# EAGLE design eCog117_Motion_Sensor (EAGLE 6.6.0)
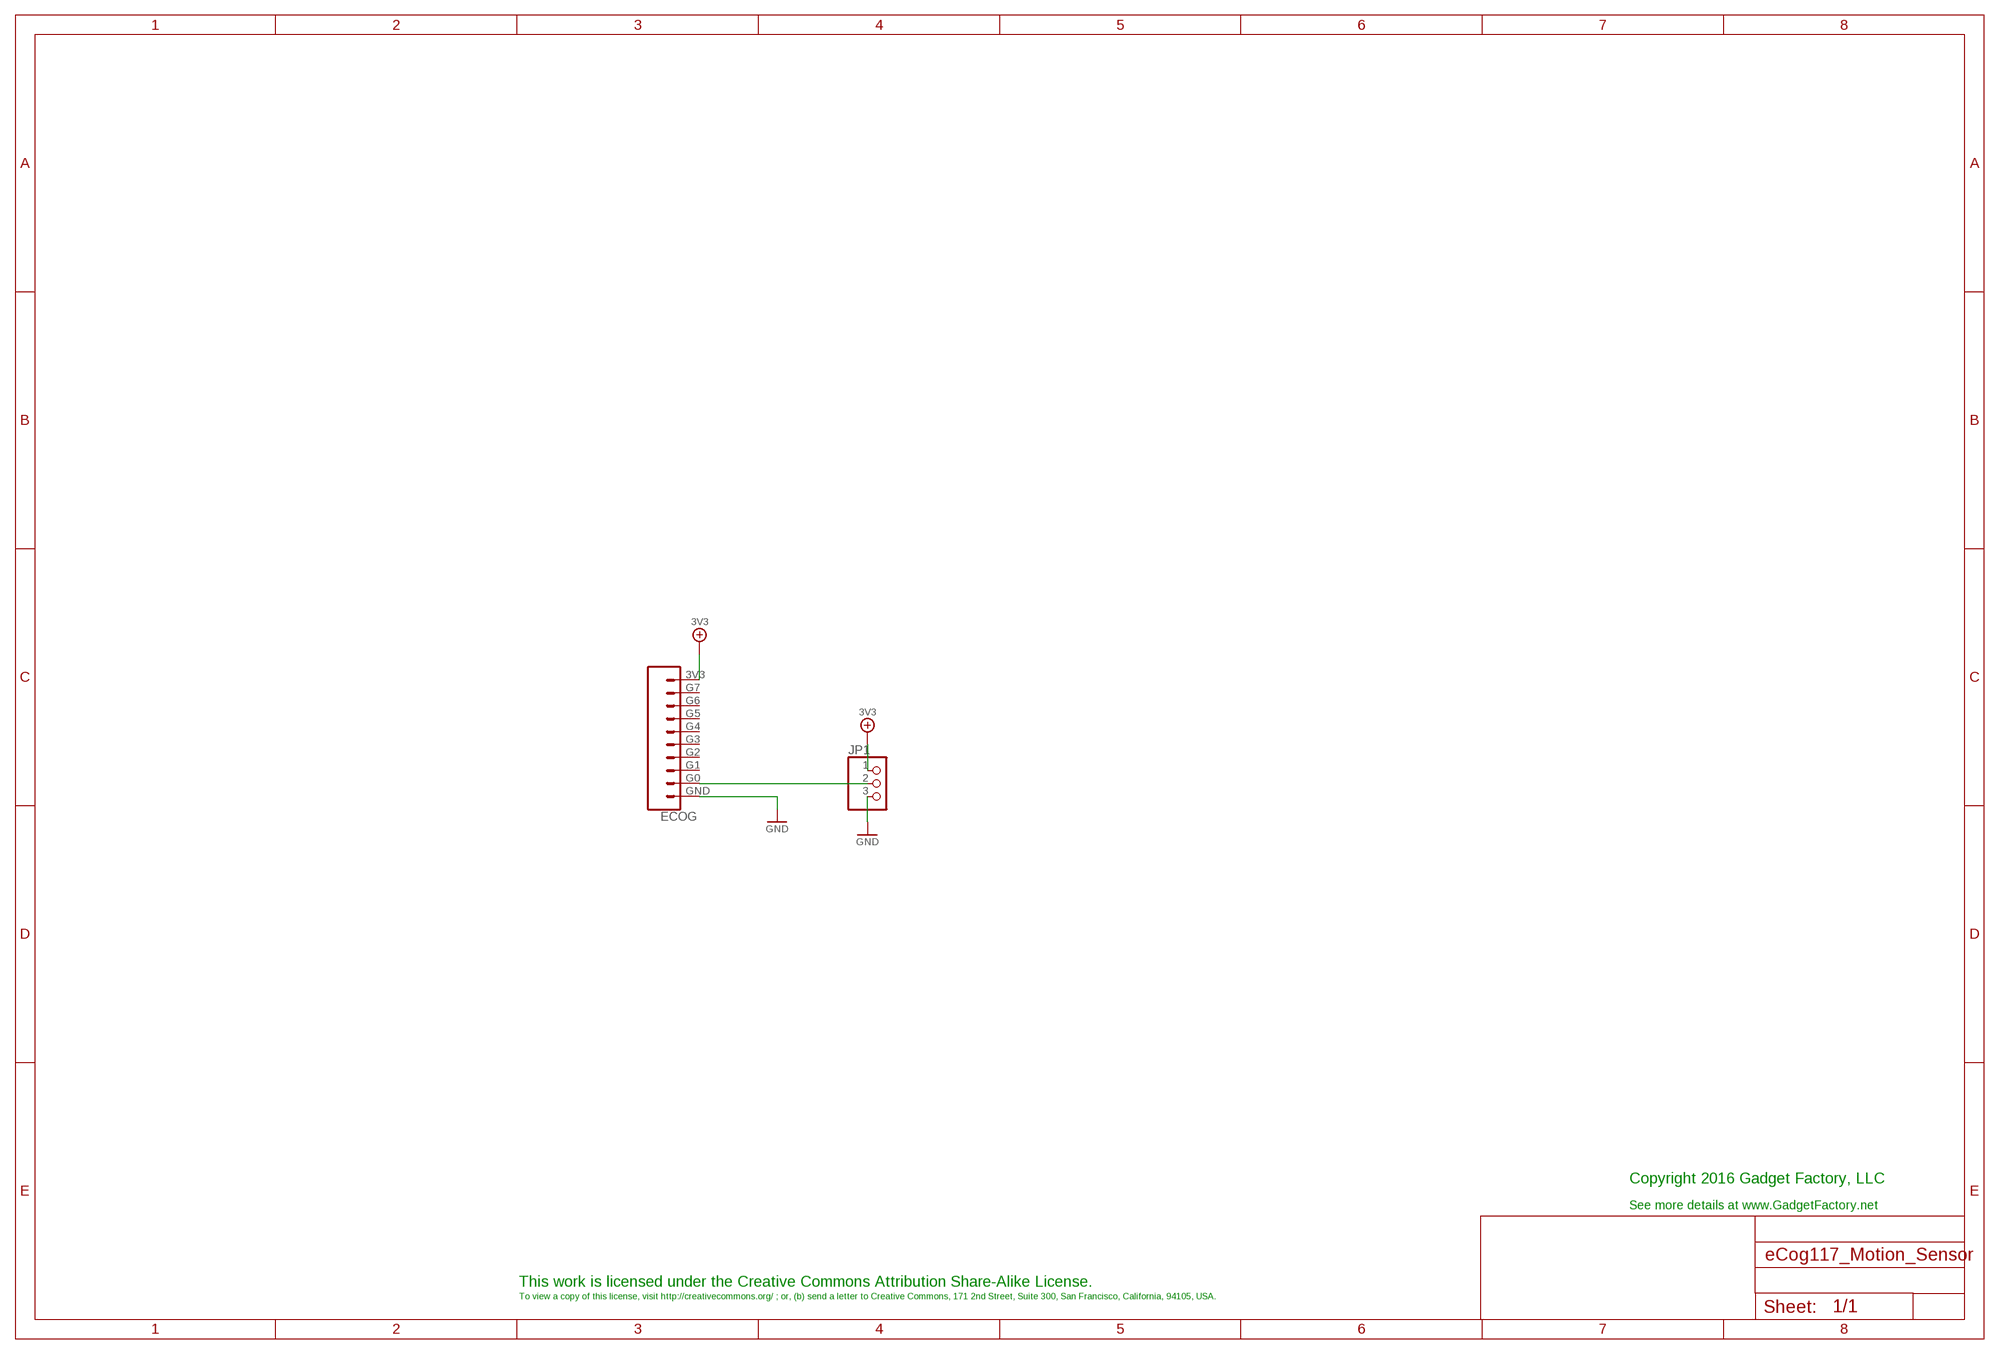
[diagram p0: schematic, sheet 1]

## Parts
ECOG  ECOG_GENERAL_ROWTHROUGHOLE  [ECOG_GENERAL_TH]
JP1  PINHD-1X3  [1X03]

## Nets
3V3: ECOG.3V3 JP1.1
GND: ECOG.GND JP1.3
N$1: ECOG.G0 JP1.2
Unconnected: ECOG.G1 ECOG.G2 ECOG.G3 ECOG.G4 ECOG.G5 ECOG.G6 ECOG.G7

## Notes on the sheet
- Copyright 2016 Gadget Factory, LLC
- See more details at www.GadgetFactory.net
- This work is licensed under the Creative Commons Attribution Share-Alike License.
- To view a copy of this license, visit http://creativecommons.org/ ; or, (b) send a letter to Creative Commons, 171 2nd Street, Suite 300, San Francisco, California, 94105, USA.

## Library data of the parts
ECOG = eCogs:ECOG_GENERAL_ROW
JP1 = pinhead:PINHD-1X3: PIN HEADER

## Board
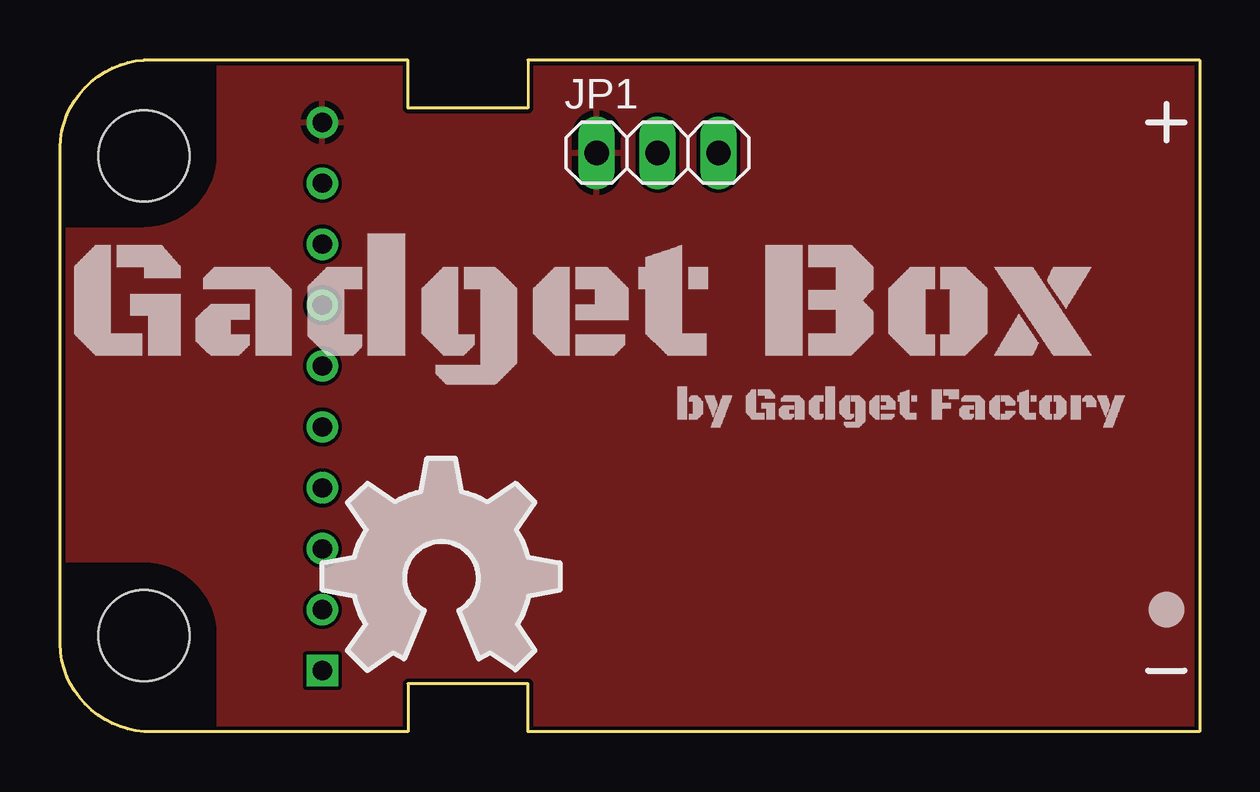
[diagram p1: board, top side]
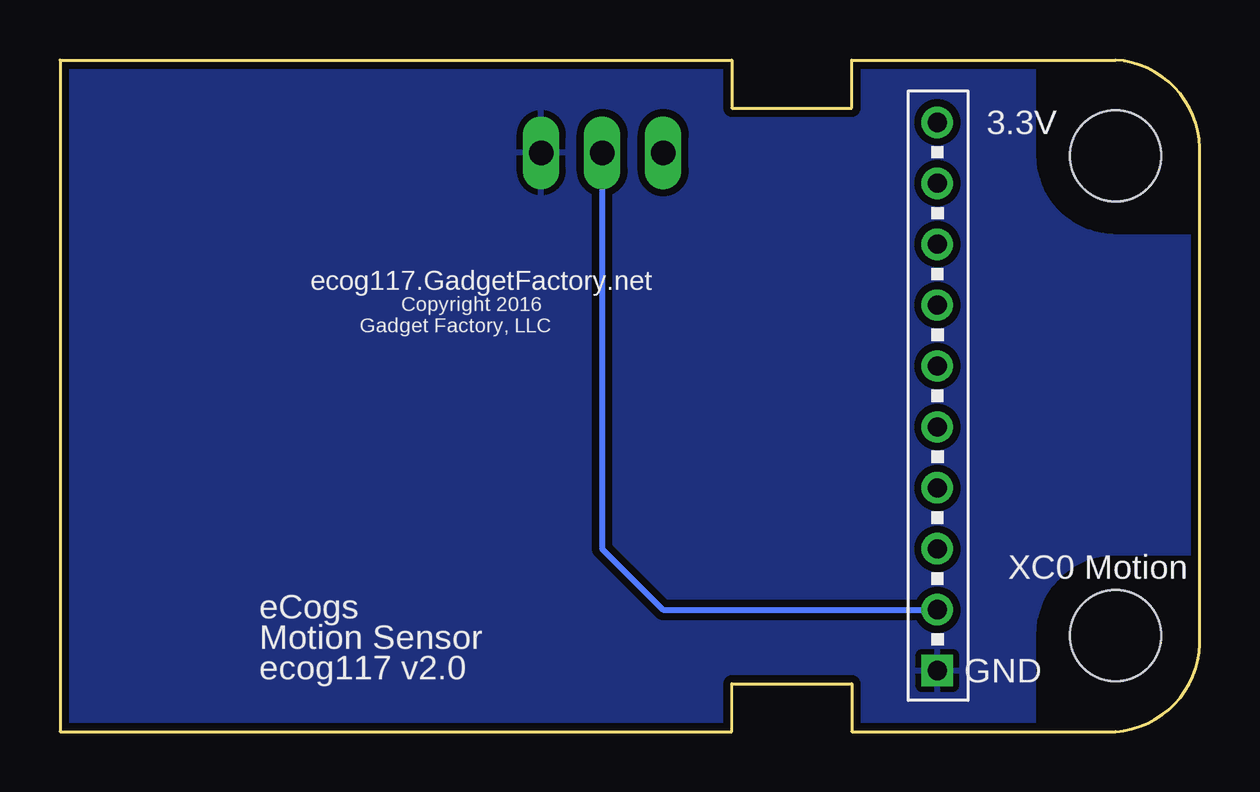
[diagram p2: board, bottom side, seen from below]

Size 47.51 x 28 mm. Coordinates in mm from the lower left corner, seen from the top.
Copper layers (1*16): Top 0.035mm / dielectric 1.5mm / Bottom 0.035mm
Design rules "hackvana *": minimum track width 6mil, minimum drill 0.3mm, track to track 6mil, track to pad 6mil, pad to pad 6mil, via to via 6mil, smd to smd 0mil, copper to edge 6mil, drill to drill 6mil, minimum pad ring 10mil, minimum via ring 6mil, stop-mask expansion 2mil, vias tented up to drill 100mil, thermal gap 10mil

### Footprints (pad centres in the part's own frame; a part is rotated, then mirrored left to right if it is on the bottom)
ECOG_GENERAL_TH = drill 0.8: 3V3 11.43,25.4; G0 11.43,5.08; G1 11.43,7.62; G2 11.43,10.16; G3 11.43,12.7; G4 11.43,15.24; G5 11.43,17.78; G6 11.43,20.32; G7 11.43,22.86 | drill 0.8 square: GND 11.43,2.54 | hole 3.8: 4,24; 4,4
1X03 = drill 1.016 long: 1 -2.54,0; 2 0,0; 3 2.54,0

### Placement (x,y rotation side)
ECOG  -0.49,0 0 top
JP1  24.91,24.13 0 top
U$1  [GADGETBOX_TEXT]  21.86,17.4 0 top
U$2  [LEGEND_DIO]  46.12,5.08 0 top
U$10  [OSHW_FILLX350_NOTEXT]  10.94,2.54 0 top

### Tracks (layer width: path | path; a pad name or v marks a point on that pad's centre or on a via)
3V3
  pour Top: -1.49,29 48.51,29 48.51,-1 -1.49,-1
GND
  pour Bottom (isolate 0.305): -2.49,30 49.51,30 49.51,-2 -2.49,-2
N$1
  Bottom 0.254: JP1.2 24.91,7.62 22.37,5.08 ECOG.G0

### Text on the board
bPlace: 3.3V | Copyright 2016 | ecog117.GadgetFactory.net | Gadget Factory, LLC | XC0 Motion | eCogs | GND | Motion Sensor | ecog117 v2.0